# EAGLE schematic sim800L_5 (EAGLE 8.6.0)
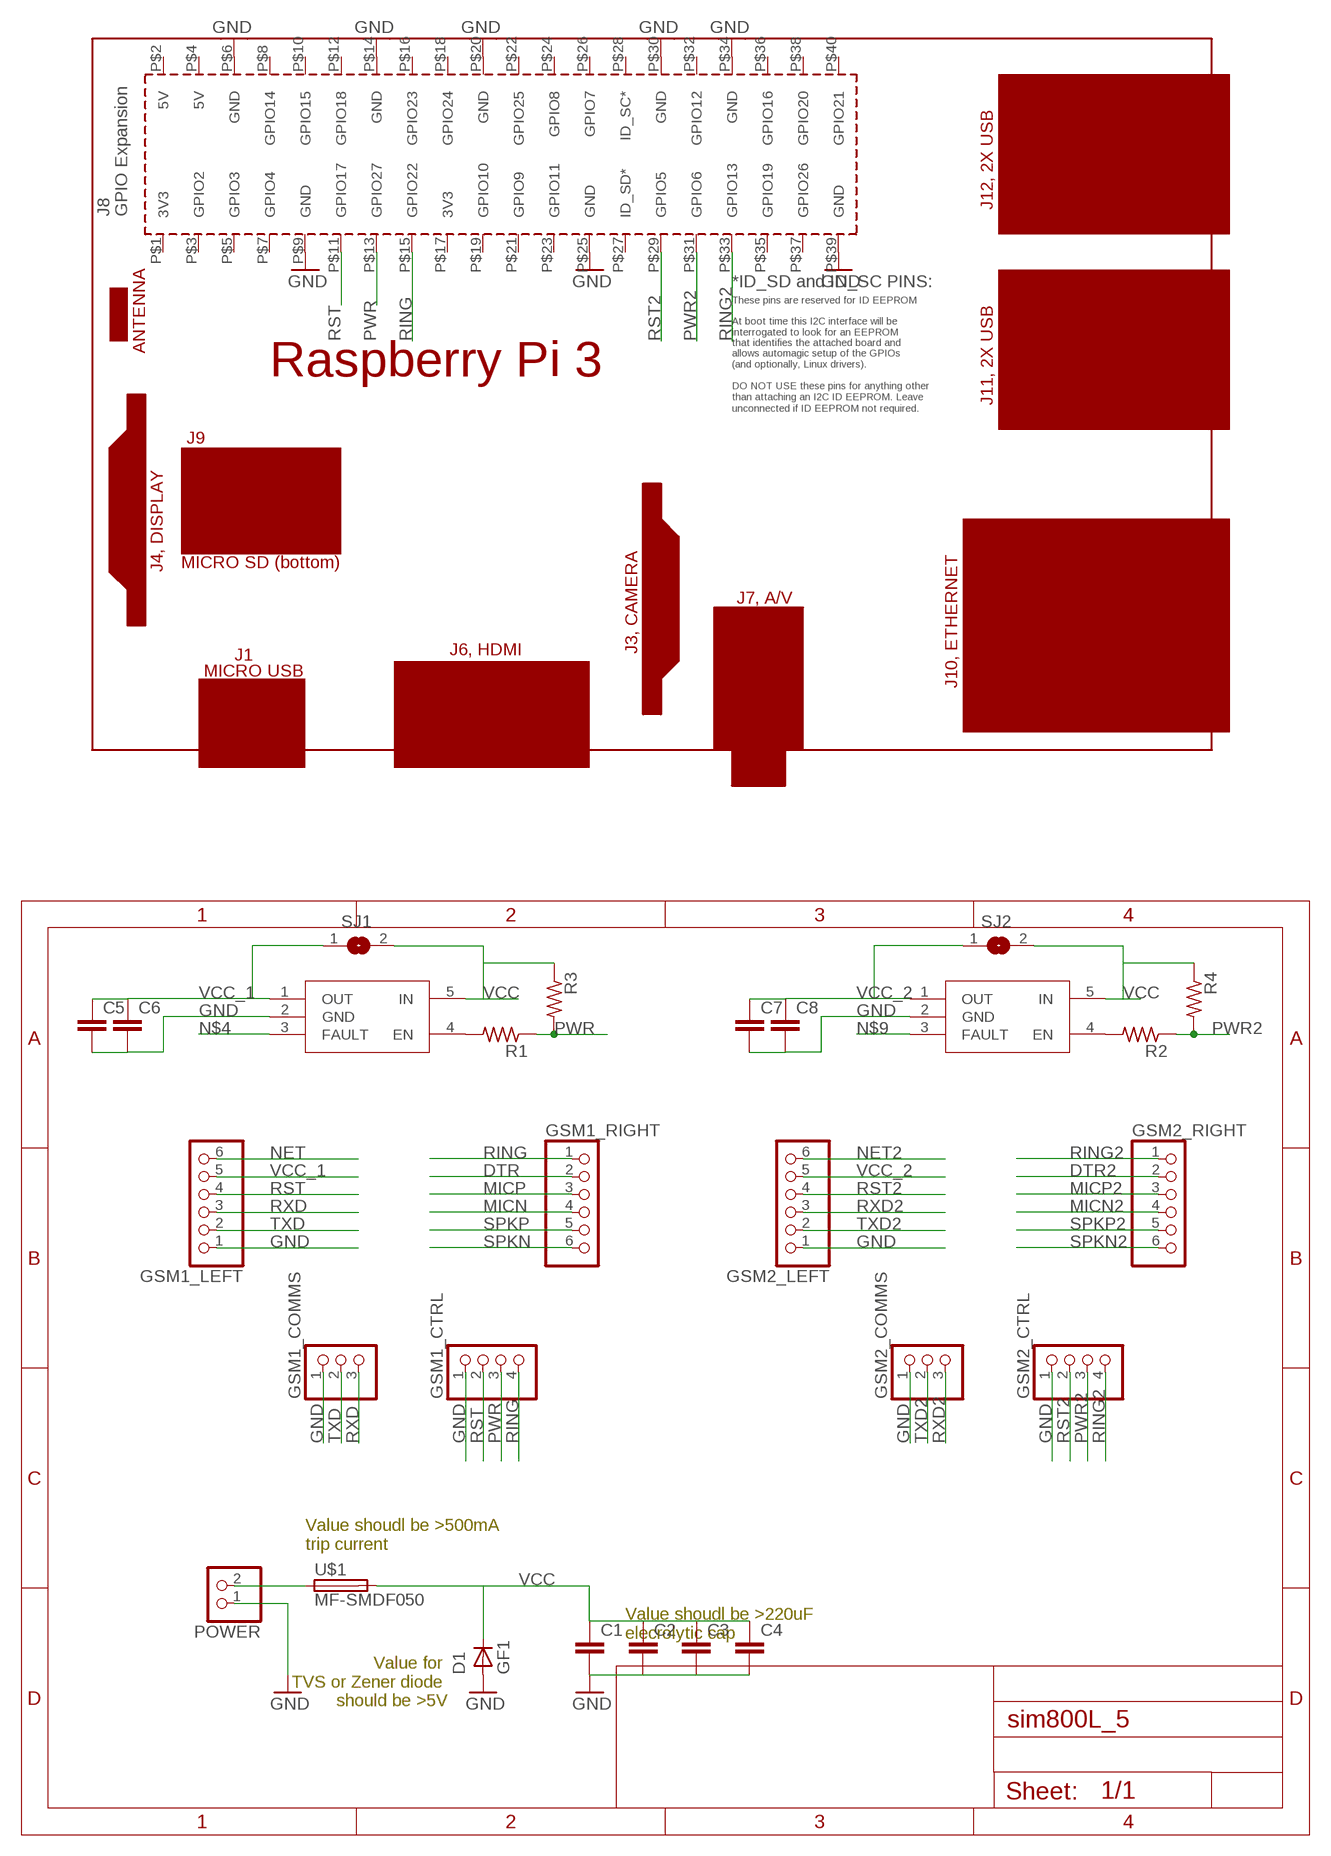
[diagram p0: schematic, sheet 1]

## Parts
C1  C-EUC1210  [C1210]
C2  C-EUC1210  [C1210]
C3  C-EUC1210  [C1210]
C4  C-EUC1210  [C1210]
C5  C-EUC4532  [C4532]
C6  C-EUC4532  [C4532]
C7  C-EUC4532  [C4532]
C8  C-EUC4532  [C4532]
D1  GF1  [SMA-DO214AC]
GSM1_COMMS  PINHD-1X3  [1X03]
GSM1_CTRL  PINHD-1X4  [1X04]
GSM1_LEFT  PINHD-1X6  [1X06]
GSM1_RIGHT  PINHD-1X6  [1X06]
GSM2_COMMS  PINHD-1X3  [1X03]
GSM2_CTRL  PINHD-1X4  [1X04]
GSM2_LEFT  PINHD-1X6  [1X06]
GSM2_RIGHT  PINHD-1X6  [1X06]
POWER  PINHD-1X2  [1X02]
R1  R-US_R0805  [R0805]
R2  R-US_R0805  [R0805]
R3  R-US_R0805  [R0805]
R4  R-US_R0805  [R0805]
SJ1  SJ  [SJ]
SJ2  SJ  [SJ]
U$1  MF-SMDF050  [MF-SMDF050]
U$2  RPI3_SHIELD  [RPI3_SHIELD]
U$3  STMPS2161STR  [SOT23-5L]
U$4  STMPS2161STR  [SOT23-5L]

## Nets
DTR: GSM1_RIGHT.2
DTR2: GSM2_RIGHT.2
GND: C1.2 C2.2 C3.2 C4.2 C5.2 C6.2 C7.2 C8.2 D1.A GSM1_COMMS.1 GSM1_CTRL.1 GSM1_LEFT.1 GSM2_COMMS.1 GSM2_CTRL.1 GSM2_LEFT.1 POWER.1 U$2.P$6(GND) U$2.P$9(GND) U$2.P$14(GND) U$2.P$20(GND) U$2.P$25(GND) U$2.P$30(GND) U$2.P$34(GND) U$2.P$39(GND) U$3.2(GND) U$4.2(GND)
MICN: GSM1_RIGHT.4
MICN2: GSM2_RIGHT.4
MICP: GSM1_RIGHT.3
MICP2: GSM2_RIGHT.3
N$1: POWER.2 U$1.1
N$2: R1.2 U$4.4(EN)
N$3: R2.2 U$3.4(EN)
N$4: U$4.3(FAULT)
N$9: U$3.3(FAULT)
NET: GSM1_LEFT.6
NET2: GSM2_LEFT.6
PWR: GSM1_CTRL.3 R1.1 R3.2 U$2.P$13(GPIO27)
PWR2: GSM2_CTRL.3 R2.1 R4.2 U$2.P$31(GPIO6)
RING: GSM1_CTRL.4 GSM1_RIGHT.1 U$2.P$15(GPIO22)
RING2: GSM2_CTRL.4 GSM2_RIGHT.1 U$2.P$33(GPIO13)
RST: GSM1_CTRL.2 GSM1_LEFT.4 U$2.P$11(GPIO17)
RST2: GSM2_CTRL.2 GSM2_LEFT.4 U$2.P$29(GPIO5)
RXD: GSM1_COMMS.3 GSM1_LEFT.3
RXD2: GSM2_COMMS.3 GSM2_LEFT.3
SPKN: GSM1_RIGHT.6
SPKN2: GSM2_RIGHT.6
SPKP: GSM1_RIGHT.5
SPKP2: GSM2_RIGHT.5
TXD: GSM1_COMMS.2 GSM1_LEFT.2
TXD2: GSM2_COMMS.2 GSM2_LEFT.2
VCC: C1.1 C2.1 C3.1 C4.1 D1.K(C) R3.1 R4.1 SJ1.2 SJ2.2 U$1.2 U$3.5(IN) U$4.5(IN)
VCC_1: C5.1 C6.1 GSM1_LEFT.5 SJ1.1 U$4.1(OUT)
VCC_2: C7.1 C8.1 GSM2_LEFT.5 SJ2.1 U$3.1(OUT)
Unconnected: U$2.P$1(3V3) U$2.P$2(5V) U$2.P$3(GPIO2) U$2.P$4(5V) U$2.P$5(GPIO3) U$2.P$7(GPIO4) U$2.P$8(GPIO14) U$2.P$10(GPIO15) U$2.P$12(GPIO18) U$2.P$16(GPIO23) U$2.P$17(3V3) U$2.P$18(GPIO24) U$2.P$19(GPIO10) U$2.P$21(GPIO9) U$2.P$22(GPIO25) U$2.P$23(GPIO11) U$2.P$24(GPIO8) U$2.P$26(GPIO7) U$2.P$27(ID_SD*) U$2.P$28(ID_SC*) U$2.P$32(GPIO12) U$2.P$35(GPIO19) U$2.P$36(GPIO16) U$2.P$37(GPIO26) U$2.P$38(GPIO20) U$2.P$40(GPIO21)

## Notes on the sheet
- Value shoudl be >500mA 
  trip current
- Value shoudl be >220uF 
  elecrolytic cap
- Value for 
  TVS or Zener diode 
  should be >5V

## Library data of the parts
C1-C8 = rcl:C-EU: CAPACITOR, European symbol; SPICEPREFIX: C
D1 = diode:GF1: DIODE
GSM1_COMMS GSM2_COMMS = pinhead:PINHD-1X3: PIN HEADER
GSM1_CTRL GSM2_CTRL = pinhead:PINHD-1X4: PIN HEADER
GSM1_LEFT GSM1_RIGHT GSM2_LEFT GSM2_RIGHT = pinhead:PINHD-1X6: PIN HEADER
POWER = pinhead:PINHD-1X2: PIN HEADER
R1-R4 = rcl:R-US_: RESISTOR, American symbol; SPICEPREFIX: R
SJ1 SJ2 = jumper:SJ: SMD solder JUMPER
U$1 = fuse:MF-SMDF: MF-SMDF Series - PRC Resettable Fuses Source: http://www.farnell.com/datasheets/716597.pdf
U$2 = e14_Rpi3_RevA:RPI3_SHIELD
U$3 U$4 = stmicro:STMPS2161STR